# Altium schematic sheet Power.SchDoc
size A4
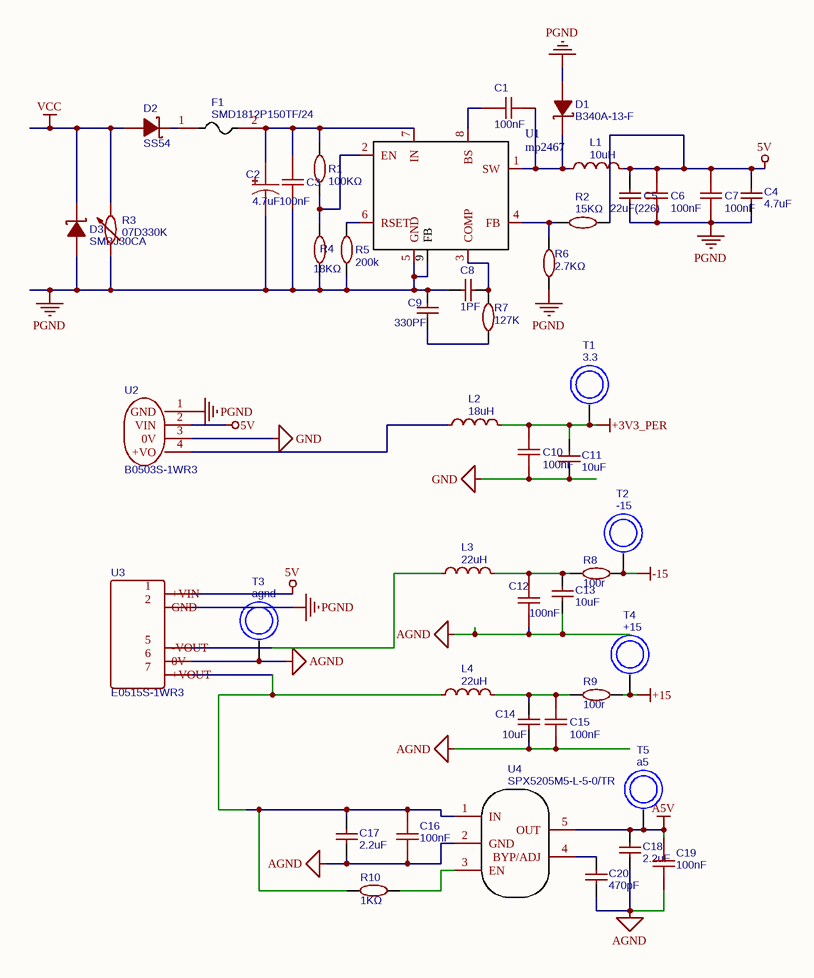
[diagram p0: Power.SchDoc]

## Parts
C1  100nF  [0603 - cap]
C2  4.7uF  [CAP-6.3*5.4]
C3  100nF  [0603 - cap]
C4  4.7uF  [1206 - cap]
C5  22uF(226)  [1206 - cap]
C6  100nF  [0603 - cap]
C7  100nF  [0603 - cap]
C8  1PF  [0603 - cap]
C9  330PF  [0603 - cap]
C10  100nF  [0603 - cap]
C11  10uF  [1206 - cap]
C12  100nF  [0603 - cap]
C13  10uF  [1206 - cap]
C14  10uF  [1206 - cap]
C15  100nF  [0603 - cap]
C16  100nF  [0603 - cap]
C17  2.2uF  [1206 - cap]
C18  2.2uF  [1206 - cap]
C19  100nF  [0603 - cap]
C20  470pF  [0603 - cap]
D1  B340A-13-F  [SMA(DO-214AC)]
D2  SS54  [SMA(DO-214AC)]
D3  SMBJ30CA  [SMB(DO-214AA)]
F1  SMD1812P150TF/24  [1812]
L1  10uH  [8040]
L2  18uH  [1220]
L3  22uH  [IND_0805]
L4  22uH  [IND_0805]
R1  100KΩ  [0603-res]
R2  15KΩ  [0603-res]
R3  07D330K  [PS-RES-9*4.7]
R4  18KΩ  [0603-res]
R5  200k  [0603-res]
R6  2.7KΩ  [0603-res]
R7  127K  [0603-res]
R8  100r  [1206-res]
R9  100r  [1206-res]
R10  1KΩ  [0603-res]
T1  3.3  [tp]
T2  -15  [tp]
T3  agnd  [tp]
T4  +15  [tp]
T5  a5  [tp]
U1  mp2467  [ESOP-8-EP]
U2  B0503S-1WR3  [B0505S-1WR2]
U3  E0515S-1WR3  [E0515S-1WR3]
U4  SPX5205M5-L-5-0/TR  [SOT-23-5]

## Nets
5V: C4.2 C5.2 C6.2 C7.2 L1.2 R2.2 U2.2(VIN) U3.1(+VIN)
+3V3_PER: C10.2 C11.1 L2.2 T1.1
+15: R9.2 T4.1
-15: R8.2 T2.1
A5V: C18.2 C19.2 T5.1 U4.5(OUT)
AGND: C12.1 C13.2 C14.2 C15.1 C16.2 C17.2 C18.1 C19.1 C20.1 T3.1 U3.6(0V) U4.2(GND)
GND: C10.1 C11.2 U2.3(0V)
PGND: C2.2 C3.1 C4.1 C5.1 C6.1 C7.1 C8.2 C9.2 D1.1(A) D3.1(A) R3.1 R4.1 R5.1 R6.1 U1.5(GND) U1.9(FB) U2.1(GND) U3.2(GND)
VCC: D2.1(A) D3.2(K) R3.2
NetC1_1: C1.1 D1.2(K) L1.1 U1.1(SW)
NetC1_2: C1.2 U1.8(BS)
NetC2_1: C2.1 C3.2 F1.2 R1.2 U1.7(IN)
NetC8_1: C8.1 R7.2 U1.3(COMP)
NetC9_1: C9.1 R7.1
NetC12_2: C12.2 C13.1 L3.2 R8.1
NetC14_1: C14.1 C15.2 L4.2 R9.1
NetC16_1: C16.1 C17.1 L4.1 R10.1 U3.7(+VOUT) U4.1(IN)
NetC20_2: C20.2 U4.4(BYP/ADJ)
NetD2_2: D2.2(K) F1.1
NetL2_1: L2.1 U2.4(+VO)
NetL3_1: L3.1 U3.5(-VOUT)
NetR1_1: R1.1 R4.2 U1.2(EN)
NetR2_1: R2.1 R6.2 U1.4(FB)
NetR5_2: R5.2 U1.6(RSET)
NetR10_2: R10.2 U4.3(EN)

## Library data of the parts
C1 C3 C6 C7 C10 C12 C15 C16 C19 = (no symbol name): BOM_Manufacturer: YAGEO; BOM_Manufacturer Part: CC0603KRX7R9BB104; nameAlias: Capacitance; BOM_Supplier: LCSC; BOM_LCSC: C14663; BOM_LCSC Assembly: Yes; spicePre: C; spiceSymbolName: CC0603KRX7R9BB104
C2 = (no symbol name): BOM_Manufacturer: HONOR; BOM_Manufacturer Part: RVT2A4R7M0605; nameAlias: Capacitance; BOM_Supplier: LCSC; BOM_LCSC: C87856; spicePre: C; spiceSymbolName: RVT2A4R7M0605
C4 = (no symbol name): BOM_Manufacturer: FH; BOM_Manufacturer Part: 1206B475K500NT; nameAlias: Capacitance; BOM_Supplier: LCSC; BOM_LCSC: C29823; BOM_LCSC Assembly: Yes; spicePre: C; spiceSymbolName: 1206B475K500NT
C5 = (no symbol name): BOM_Manufacturer: FH; BOM_Manufacturer Part: 1206F226M100NT; nameAlias: Value; Contributor: LCSC; BOM_Supplier: LCSC; BOM_LCSC: C108718; spicePre: C; spiceSymbolName: 1206F226M100NT
C8 C9 = (no symbol name): BOM_Manufacturer: FH; BOM_Manufacturer Part: 0603B472K500NT; nameAlias: Capacitance; BOM_Supplier: LCSC; BOM_LCSC: C53987; BOM_LCSC Assembly: Yes; spicePre: C; spiceSymbolName: 0603B472K500NT
C11 C13 C14 C17 C18 = (no symbol name): BOM_Manufacturer Part: CL31B225KBHNNNE; BOM_Manufacturer: SAMSUNG; nameAlias: Capacitance; BOM_Supplier: LCSC; BOM_LCSC: C50254; BOM_LCSC Assembly: Yes; spicePre: C; spiceSymbolName: CL31B225KBHNNNE
C20 = (no symbol name): BOM_Manufacturer: FH; BOM_Manufacturer Part: 0603B471K500NT; nameAlias: Capacitance; BOM_Supplier: LCSC; BOM_LCSC: C1620; BOM_LCSC Assembly: Yes; spicePre: C; spiceSymbolName: 0603B471K500NT
D1 = (no symbol name): BOM_Manufacturer: DIODES; BOM_Supplier: LCSC; BOM_Manufacturer Part: B340A-13-F; BOM_LCSC: C85098; spicePre: D
D2 D3 = (no symbol name): BOM_Manufacturer: MDD; BOM_Supplier: LCSC; spicePre: D
  D2: BOM_Manufacturer Part: SS54; BOM_LCSC: C22452; BOM_LCSC Assembly: Yes; image: //image.lceda.cn/szlcsc/C22452.jpg
  D3: BOM_Manufacturer Part: SMBJ30CA; BOM_LCSC: C113999
F1 = (no symbol name): BOM_Manufacturer: RUILON; BOM_Supplier: LCSC; BOM_Manufacturer Part: SMD1812P150TF/24; BOM_LCSC: C32404; image: //image.lceda.cn/szlcsc/C32404.jpg; spicePre: F
L1 L3 L4 = (no symbol name): BOM_Manufacturer: TDK; BOM_Manufacturer Part: VLP8040T-100M; nameAlias: Inductance; BOM_Supplier: LCSC; BOM_LCSC: C107345; spicePre: L; spiceSymbolName: VLP8040T-100M
L2 = (no symbol name): BOM_Manufacturer: Sunlord; BOM_Manufacturer Part: SPH252012H180MT; nameAlias: Inductance; BOM_Supplier: LCSC; BOM_LCSC: C98384; spicePre: L; spiceSymbolName: SPH252012H180MT
R1 = (no symbol name): BOM_Manufacturer: UniOhm; BOM_Manufacturer Part: 0603WAF1003T5E; nameAlias: Value; BOM_Supplier: LCSC; BOM_LCSC: C25803; BOM_LCSC Assembly: Yes; spicePre: R; spiceSymbolName: 0603WAF1003T5E
R2 R6 R10 = (no symbol name): BOM_Manufacturer: UniOhm; BOM_Manufacturer Part: 0603WAF2002T5E; nameAlias: Value; BOM_Supplier: LCSC; BOM_LCSC: C4184; BOM_LCSC Assembly: Yes; spicePre: R; spiceSymbolName: 0603WAF2002T5E
R3 = (no symbol name): BOM_Manufacturer: RUILON; nameAlias: Value; BOM_Supplier: LCSC; BOM_Manufacturer Part: 07D330K; BOM_LCSC: C26299; spicePre: R; spiceSymbolName: 07D330K
R4 R5 = (no symbol name): BOM_Manufacturer: UniOhm; BOM_Manufacturer Part: 0603WAF1502T5E; nameAlias: Value; BOM_Supplier: LCSC; BOM_LCSC: C22809; BOM_LCSC Assembly: Yes; spicePre: R; spiceSymbolName: 0603WAF1502T5E
R7 = (no symbol name): BOM_Manufacturer: UniOhm; BOM_Manufacturer Part: 0603WAF1302T5E; nameAlias: Resistance (Ohms); BOM_Supplier: LCSC; BOM_LCSC: C22797; BOM_LCSC Assembly: Yes; spicePre: R; spiceSymbolName: 0603WAF1302T5E
R8 R9 = (no symbol name): BOM_Manufacturer: UniOhm; BOM_Manufacturer Part: 0603WAF1001T5E; nameAlias: Value; BOM_Supplier: LCSC; BOM_LCSC: C21190; BOM_LCSC Assembly: Yes; spicePre: R; spiceSymbolName: 0603WAF1001T5E
U2 U3 = (no symbol name): BOM_Manufacturer: MORNSUN; BOM_Supplier: LCSC; spicePre: U
  U2: BOM_Manufacturer Part: B0503S-1WR3; BOM_LCSC: C131168
  U3: BOM_Manufacturer Part: E0515S-1WR3; BOM_LCSC: C131169
U4 = (no symbol name): BOM_Manufacturer: EXAR; BOM_Supplier: LCSC; BOM_Manufacturer Part: SPX5205M5-L-5-0/TR; BOM_LCSC: C6865; image: //image.lceda.cn/szlcsc/C6865.jpg; spicePre: U
T1-T5 = (no symbol name): BOM_Manufacturer Part: ?; spicePre: T